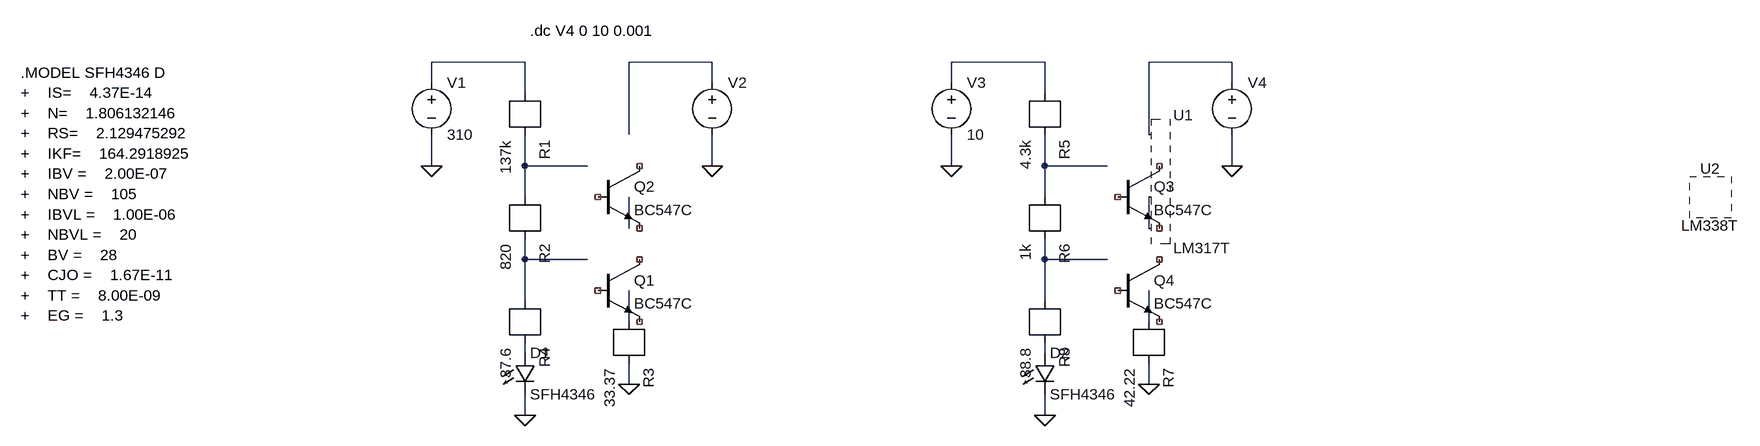
[diagram p0: schematic amp_TCC_current_V0.1.asc]
amp_TCC_current_V0.1.asc, the LTspice schematic file:
Version 4
SHEET 1 4376 1040
WIRE 464 416 320 416
WIRE 752 416 624 416
WIRE 1264 416 1120 416
WIRE 1552 416 1424 416
WIRE 320 448 320 416
WIRE 752 448 752 416
WIRE 1120 448 1120 416
WIRE 1552 448 1552 416
WIRE 464 464 464 416
WIRE 1264 464 1264 416
WIRE 624 528 624 416
WIRE 1424 528 1424 416
WIRE 320 576 320 528
WIRE 464 576 464 528
WIRE 560 576 464 576
WIRE 752 576 752 528
WIRE 1120 576 1120 528
WIRE 1264 576 1264 528
WIRE 1360 576 1264 576
WIRE 1552 576 1552 528
WIRE 464 624 464 576
WIRE 1264 624 1264 576
WIRE 624 672 624 624
WIRE 1424 672 1424 624
WIRE 464 720 464 688
WIRE 560 720 464 720
WIRE 1264 720 1264 688
WIRE 1360 720 1264 720
WIRE 464 784 464 720
WIRE 1264 784 1264 720
WIRE 624 816 624 768
WIRE 1424 816 1424 768
WIRE 464 864 464 848
WIRE 1264 864 1264 848
WIRE 624 912 624 880
WIRE 1424 912 1424 880
WIRE 464 960 464 928
WIRE 1264 960 1264 928
FLAG 320 576 0
FLAG 752 576 0
FLAG 624 912 0
FLAG 464 960 0
FLAG 1120 576 0
FLAG 1552 576 0
FLAG 1424 912 0
FLAG 1264 960 0
SYMBOL LED 448 864 R0
SYMATTR InstName D1
SYMATTR Value SFH4346
SYMBOL voltage 320 432 R0
SYMATTR InstName V1
SYMATTR Value 310
SYMBOL r 464 464 R90
SYMATTR InstName R1
SYMATTR Value 137k
SYMBOL r 464 624 R90
SYMATTR InstName R2
SYMATTR Value 820
SYMBOL voltage 752 432 R0
SYMATTR InstName V2
SYMATTR Value ""
SYMBOL r 624 816 R90
SYMATTR InstName R3
SYMATTR Value 33.37
SYMBOL npn 576 576 R0
SYMATTR InstName Q2
SYMATTR Value BC547C
SYMBOL npn 576 720 R0
SYMATTR InstName Q1
SYMATTR Value BC547C
SYMBOL r 464 784 R90
SYMATTR InstName R4
SYMATTR Value 37.6
SYMBOL LED 1248 864 R0
SYMATTR InstName D2
SYMATTR Value SFH4346
SYMBOL voltage 1120 432 R0
SYMATTR InstName V3
SYMATTR Value 10
SYMBOL r 1264 464 R90
SYMATTR InstName R5
SYMATTR Value 4.3k
SYMBOL r 1264 624 R90
SYMATTR InstName R6
SYMATTR Value 1k
SYMBOL voltage 1552 432 R0
SYMATTR InstName V4
SYMATTR Value ""
SYMBOL r 1424 816 R90
SYMATTR InstName R7
SYMATTR Value 42.22
SYMBOL npn 1376 576 R0
SYMATTR InstName Q3
SYMATTR Value BC547C
SYMBOL npn 1376 720 R0
SYMATTR InstName Q4
SYMATTR Value BC547C
SYMBOL r 1264 784 R90
SYMATTR InstName R8
SYMATTR Value 38.8
SYMBOL Reguladores/LM317T 1968 624 R0
SYMATTR InstName U1
SYMBOL Reguladores/LM338T 2288 624 R0
SYMATTR InstName U2
TEXT 472 368 Left 2 !.dc V4 0 10 0.001
TEXT -312 432 Left 2 !.MODEL SFH4346 D	\n+	IS=	4.37E-14\n+	N=	1.806132146\n+	RS=	2.129475292\n+	IKF=	164.2918925\n+	IBV =	2.00E-07\n+	NBV =	105\n+	IBVL =	1.00E-06\n+	NBVL =	20\n+	BV =	28\n+	CJO =	1.67E-11\n+	TT =	8.00E-09\n+	EG =	1.3

The netlist it stands for:
* amp_TCC_current_V0.1.asc
D1 N013 0 SFH4346
V1 N001 0 310
R1 N005 N001 137k
R2 N009 N005 820
V2 N002 0
R3 0 N011 33.37
* Q2: BC547C (symbol npn not certain, pin order unknown); nets seen at it: 0
* Q1: BC547C (symbol npn not certain, pin order unknown); nets seen at it: 0
R4 N013 N009 37.6
D2 N014 0 SFH4346
V3 N003 0 10
R5 N006 N003 4.3k
R6 N010 N006 1k
V4 N004 0
R7 0 N012 42.22
Q3 NC_07 NC_08 NC_09 0 BC547C
* Q4: BC547C (symbol npn not certain, pin order unknown); nets seen at it: 0
R8 N014 N010 38.8
* U1: LM317T (symbol Reguladores/LM317T not available, pin order unknown); nets seen at it: N004, N008
* U2: LM338T (symbol Reguladores/LM338T not available, pin order unknown); nets seen at it: 
.model D D
.lib standard.dio
.model NPN NPN
.model PNP PNP
.lib standard.bjt
.dc V4 0 10 0.001
.MODEL SFH4346 D
+	IS=	4.37E-14
+	N=	1.806132146
+	RS=	2.129475292
+	IKF=	164.2918925
+	IBV =	2.00E-07
+	NBV =	105
+	IBVL =	1.00E-06
+	NBVL =	20
+	BV =	28
+	CJO =	1.67E-11
+	TT =	8.00E-09
+	EG =	1.3
.backanno
.end